# EAGLE design control_avr_rev_a (EAGLE 6.1)

## Sheet 1 of 4: Microcontroller
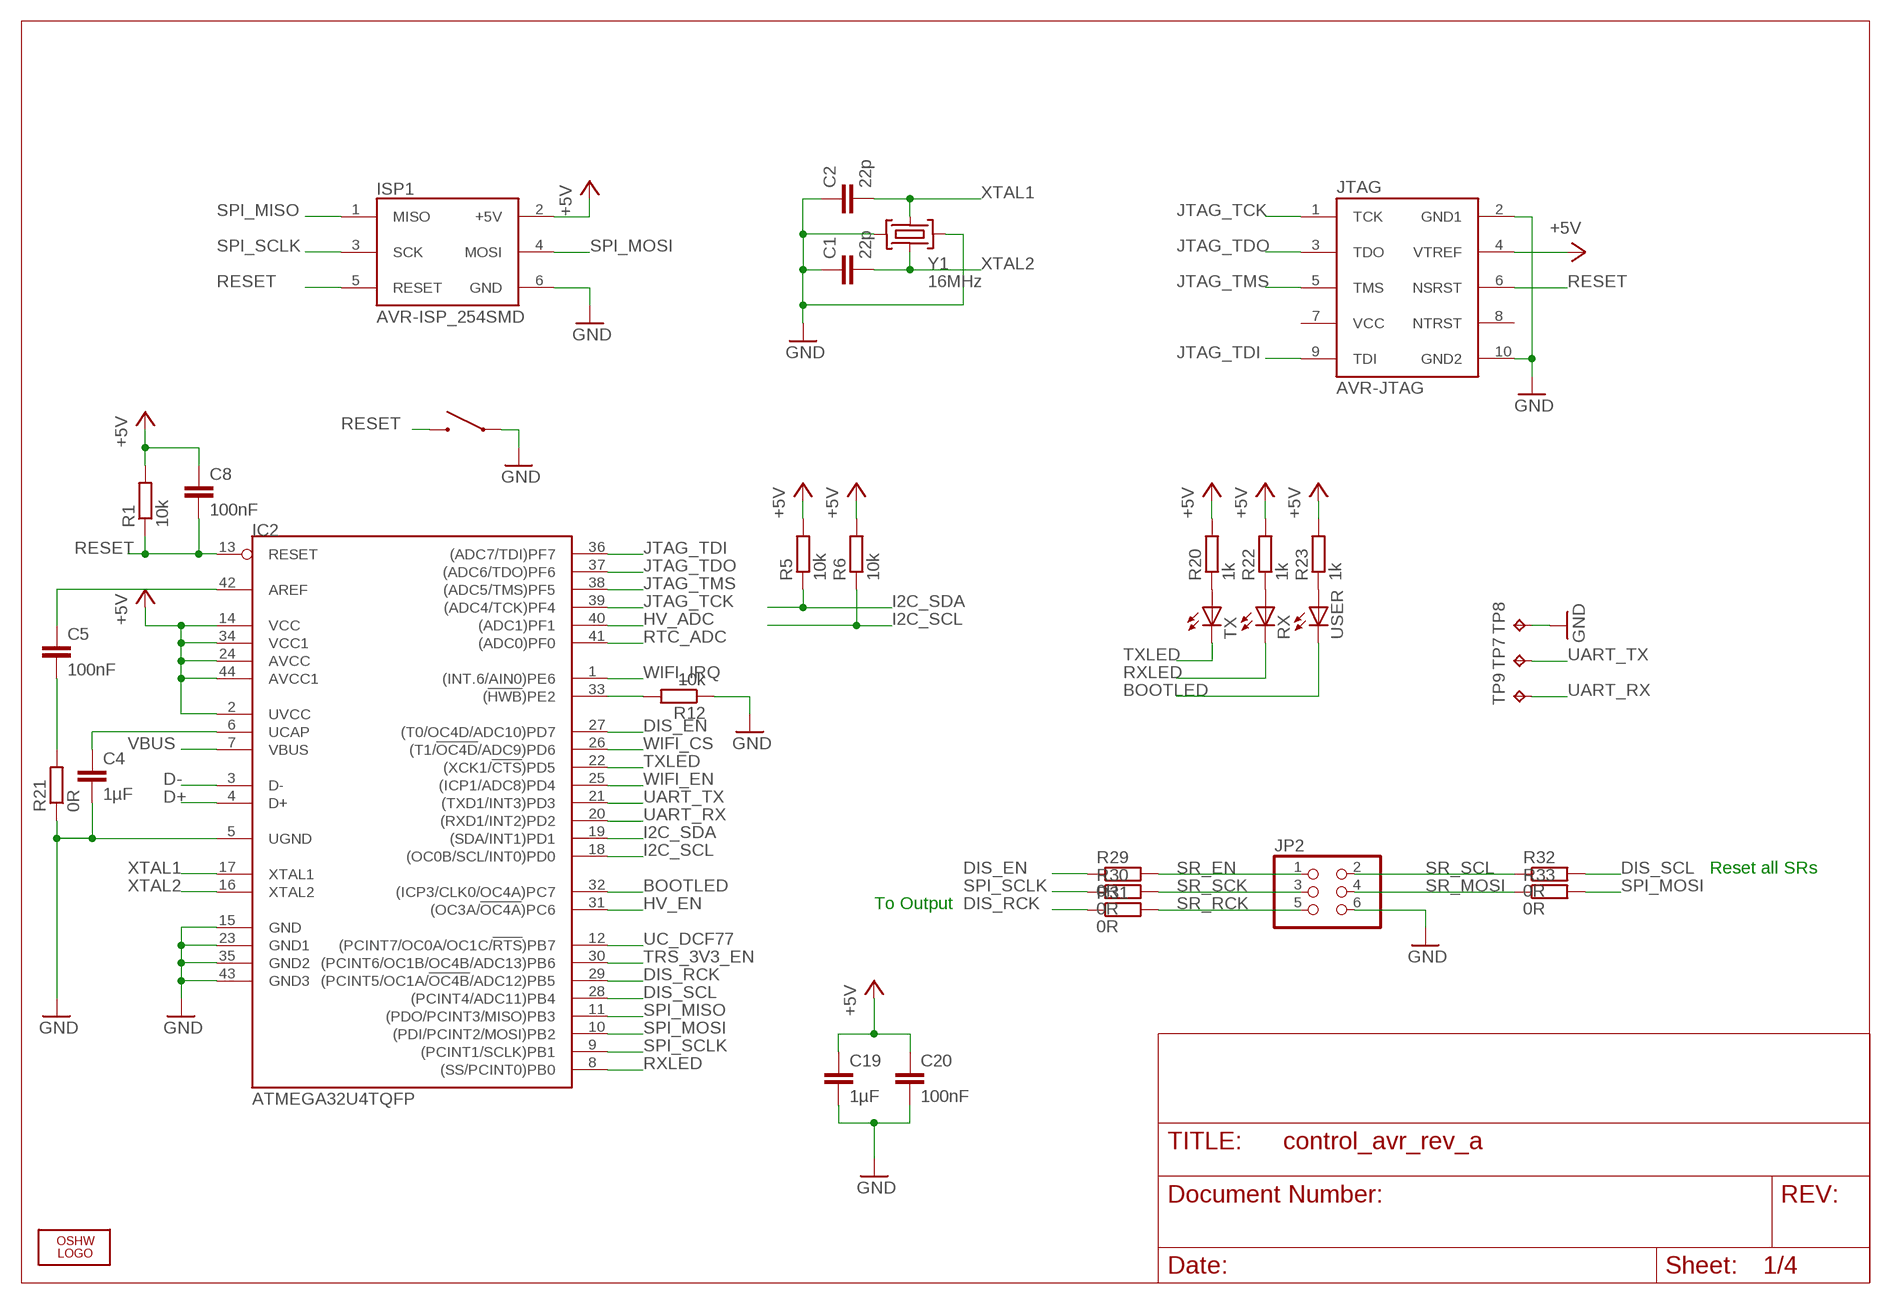
[diagram p0: schematic, sheet 1]

### Parts
C1  22p  C-EUC0603  [C0603]
C2  22p  C-EUC0603  [C0603]
C4  1µF  C-EUC0603  [C0603]
C5  100nF  C-EUC0603  [C0603]
C8  100nF  C-EUC0603  [C0603]
C19  1µF  C-EUC0603  [C0603]
C20  100nF  C-EUC0603  [C0603]
IC2  ATMEGA32U4TQFP  [TQFP44]
ISP1  AVR-ISP_254SMD  [2X03SMD]
JP2  PINHD-2X3_2.54-SMD-R  [2X03SMD/R]
JTAG  AVR-JTAG  [20021121-10010XXLF]
LOGO1  OSHW_LOGO_FILLX0200-NT  [OSHW_FILLX200_NOTEXT]
R1  10k  R-EU_R0603  [R0603]
R5  10k  R-EU_R0603  [R0603]
R6  10k  R-EU_R0603  [R0603]
R12  10k  R-EU_R0603  [R0603]
R20  1k  R-EU_R0603  [R0603]
R21  0R  R-EU_R0603  [R0603]
R22  1k  R-EU_R0603  [R0603]
R23  1k  R-EU_R0603  [R0603]
R29  0R  R-EU_R0603  [R0603]
R30  0R  R-EU_R0603  [R0603]
R31  0R  R-EU_R0603  [R0603]
R32  0R  R-EU_R0603  [R0603]
R33  0R  R-EU_R0603  [R0603]
RESET  TACT-SWITCH-47-35  [47-35]
RX  LEDCHIP-LED0603  [CHIP-LED0603]
TP7  TPTP10R  [TP10R]
TP8  TPTP10SQ  [TP10SQ]
TP9  TPTP10R  [TP10R]
TX  LEDCHIP-LED0603  [CHIP-LED0603]
USER  LEDCHIP-LED0603  [CHIP-LED0603]
Y1  16MHz  X22-CRYSTAL  [X22]

### Nets
+5V: C8.1 C19.1 C20.1 IC2.2(UVCC) IC2.14(VCC) IC2.24(AVCC) IC2.34(VCC1) IC2.44(AVCC1) ISP1.2(+5V) JTAG.4(VTREF) R1.2 R5.2 R6.2 R20.2 R22.2 R23.2 ; also sheet 2,4
BOOTLED: IC2.32((ICP3/CLK0/OC4A)PC7) USER.C
D+: IC2.4(D+) ; also sheet 4
D-: IC2.3(D-) ; also sheet 4
DIS_EN: IC2.27((T0/OC4D/ADC10)PD7) R29.1
DIS_RCK: IC2.29((PCINT5/OC1A/!OC4B!/ADC12)PB5) R31.1
DIS_SCL: IC2.28((PCINT4/ADC11)PB4) R32.2
GND: C1.1 C2.1 C4.2 C19.2 C20.2 IC2.5(UGND) IC2.15(GND) IC2.23(GND1) IC2.35(GND2) IC2.43(GND3) ISP1.6(GND) JP2.6 JTAG.2(GND1) JTAG.10(GND2) R12.1 R21.1 RESET.C RESET.D TP8.TP Y1.P$1(GND1) Y1.P$3(GND2) ; also sheet 2,3,4
HV_ADC: IC2.40((ADC1)PF1) ; also sheet 4
HV_EN: IC2.31((OC3A/!OC4A!)PC6) ; also sheet 4
I2C_SCL: IC2.18((OC0B/SCL/INT0)PD0) R6.1 ; also sheet 2
I2C_SDA: IC2.19((SDA/INT1)PD1) R5.1 ; also sheet 2
JTAG_TCK: IC2.39((ADC4/TCK)PF4) JTAG.1(TCK)
JTAG_TDI: IC2.36((ADC7/TDI)PF7) JTAG.9(TDI)
JTAG_TDO: IC2.37((ADC6/TDO)PF6) JTAG.3(TDO)
JTAG_TMS: IC2.38((ADC5/TMS)PF5) JTAG.5(TMS)
N$3: R20.1 TX.A
N$6: IC2.33((!HWB!)PE2) R12.2
N$8: C5.2 R21.2
N$9: C5.1 IC2.42(AREF)
N$10: R22.1 RX.A
N$11: R23.1 USER.A
RESET: C8.2 IC2.13(RESET) ISP1.5(RESET) JTAG.6(NSRST) R1.1 RESET.A RESET.B
RTC_ADC: IC2.41((ADC0)PF0) ; also sheet 2
RXLED: IC2.8((SS/PCINT0)PB0) RX.C
SPI_MISO: IC2.11((PDO/PCINT3/MISO)PB3) ISP1.1(MISO) ; also sheet 3
SPI_MOSI: IC2.10((PDI/PCINT2/MOSI)PB2) ISP1.4(MOSI) R33.2 ; also sheet 3
SPI_SCLK: IC2.9((PCINT1/SCLK)PB1) ISP1.3(SCK) R30.1 ; also sheet 3
SR_EN: JP2.1 R29.2
SR_MOSI: JP2.4 R33.1
SR_RCK: JP2.5 R31.2
SR_SCK: JP2.3 R30.2
SR_SCL: JP2.2 R32.1
TRS_3V3_EN: IC2.30((PCINT6/OC1B/OC4B/ADC13)PB6) ; also sheet 4
TXLED: IC2.22((XCK1/!CTS!)PD5) TX.C
UART_RX: IC2.20((RXD1/INT2)PD2) TP9.TP ; also sheet 2
UART_TX: IC2.21((TXD1/INT3)PD3) TP7.TP
UC_DCF77: IC2.12((PCINT7/OC0A/OC1C/!RTS!)PB7) ; also sheet 2
UCAP: C4.1 IC2.6(UCAP)
VBUS: IC2.7(VBUS)
WIFI_CS: IC2.26((T1/!OC4D!/ADC9)PD6) ; also sheet 3
WIFI_EN: IC2.25((ICP1/ADC8)PD4) ; also sheet 3
WIFI_IRQ: IC2.1((INT.6/AIN0)PE6) ; also sheet 3
XTAL1: C2.2 IC2.17(XTAL1) Y1.CRYSTAL2
XTAL2: C1.2 IC2.16(XTAL2) Y1.CRYSTAL1
Unconnected: JTAG.7(VCC) JTAG.8(NTRST)

### Notes on the sheet
- Reset all SRs
- To Output

## Sheet 2 of 4: Timesources
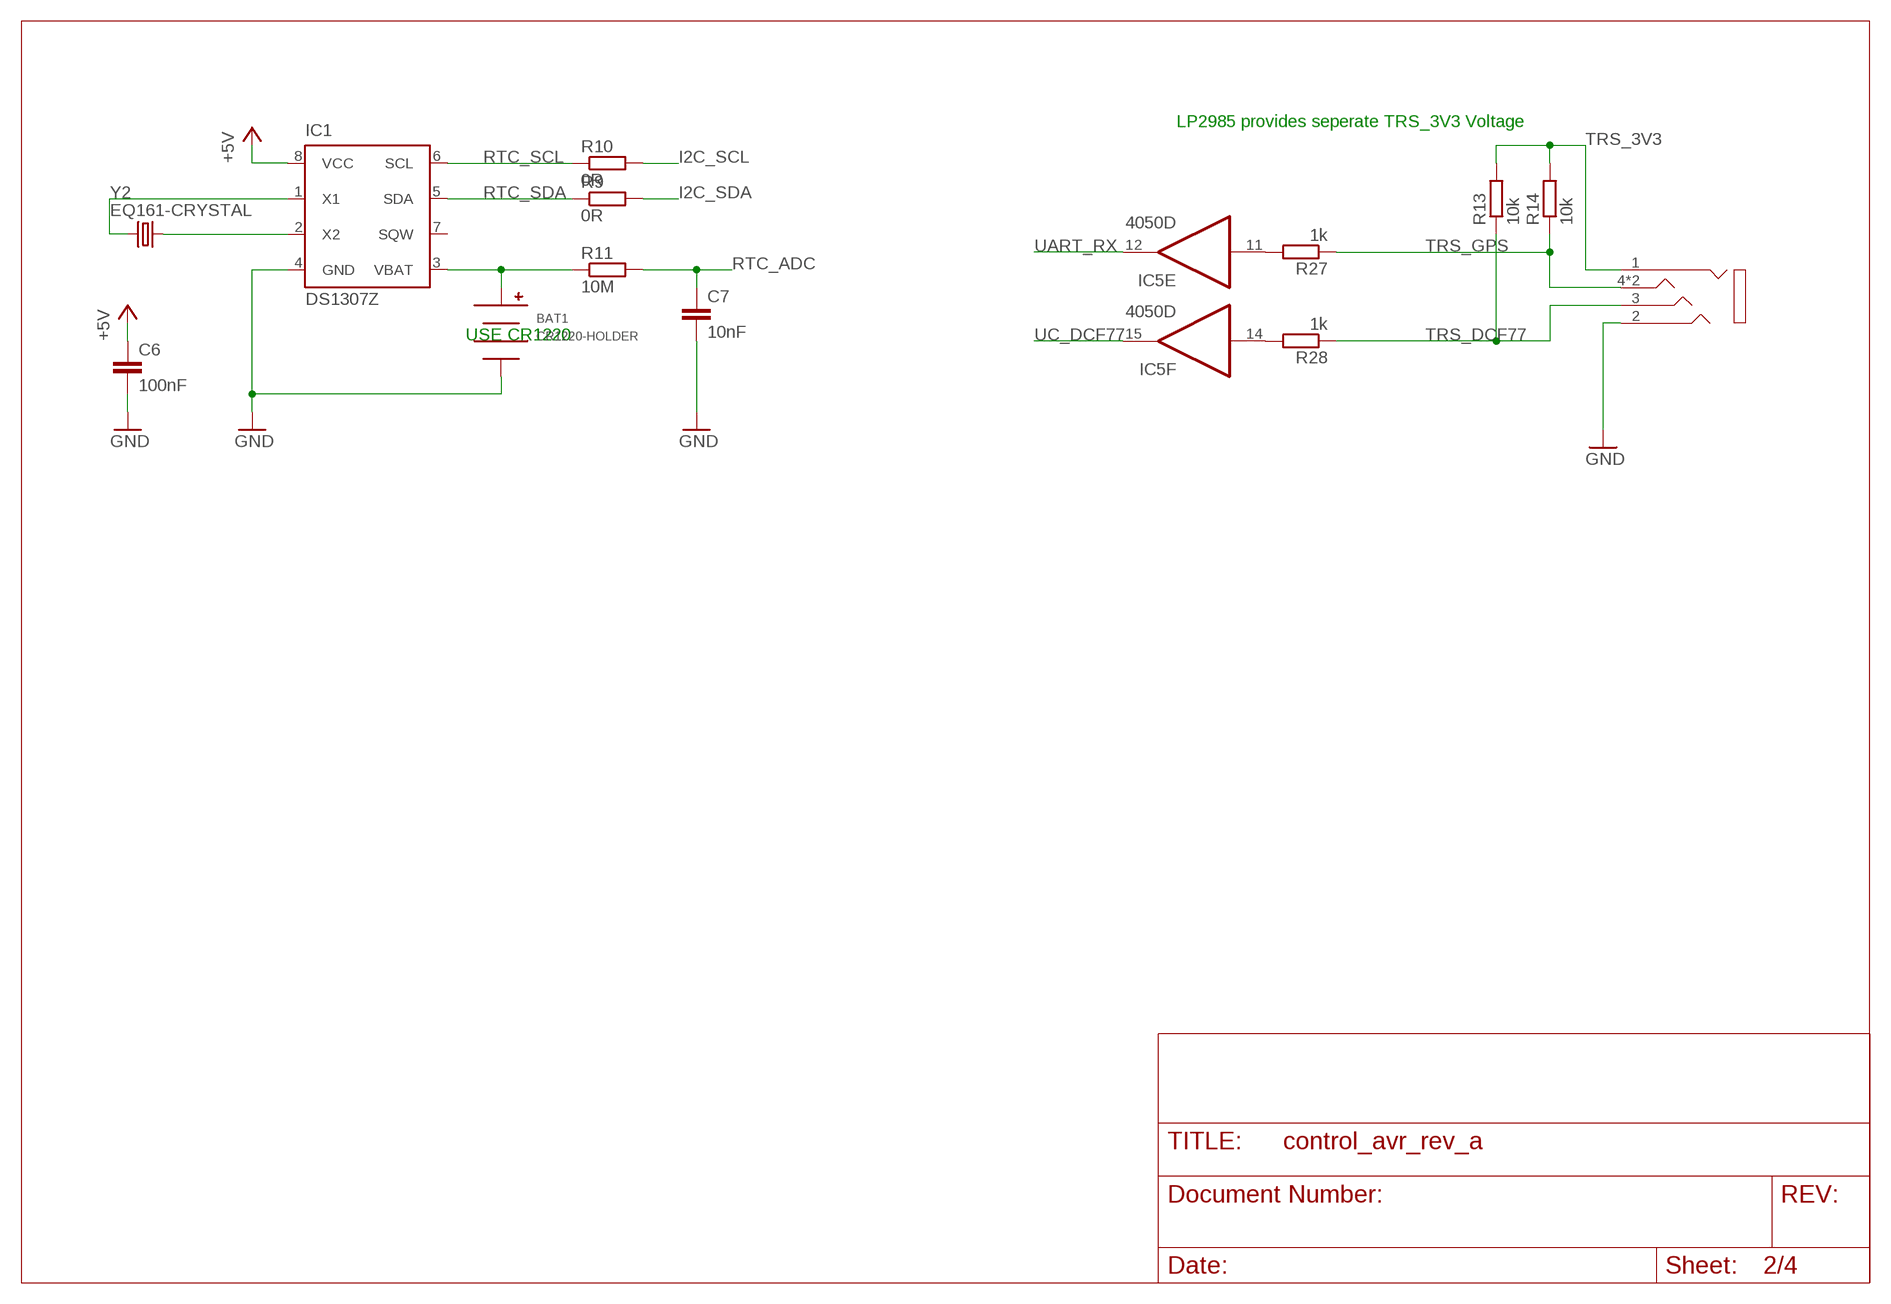
[diagram p1: schematic, sheet 2]

### Parts
BAT1  CR1220-HOLDER  [HARWIN-CR1220]
C6  100nF  C-EUC0603  [C0603]
C7  10nF  C-EUC0603  [C0603]
IC1  DS1307Z  [SOIC8]
IC5  4050D  [SO16]
R9  0R  R-EU_R0603  [R0603]
R10  0R  R-EU_R0603  [R0603]
R11  10M  R-EU_R0603  [R0603]
R13  10k  R-EU_R0603  [R0603]
R14  10k  R-EU_R0603  [R0603]
R27  1k  R-EU_R0603  [R0603]
R28  1k  R-EU_R0603  [R0603]
U$3  1503_13  [1503-03]
Y2  EQ161-CRYSTAL  [EQ161]

### Nets
+5V: C6.1 IC1.8(VCC) ; also sheet 1,4
GND: BAT1.NEG C6.2 C7.2 IC1.4(GND) U$3.2 ; also sheet 1,3,4
I2C_SCL: R10.2 ; also sheet 1
I2C_SDA: R9.2 ; also sheet 1
N$4: IC1.1(X1) Y2.P$2
N$5: BAT1.POS IC1.3(VBAT) R11.1
N$7: IC1.2(X2) Y2.P$1
N$15: IC5.11(E:I) R27.2
N$30: IC5.14(F:I) R28.2
RTC_ADC: C7.1 R11.2 ; also sheet 1
RTC_SCL: IC1.6(SCL) R10.1
RTC_SDA: IC1.5(SDA) R9.1
TRS_3V3: R13.2 R14.2 U$3.1 ; also sheet 4
TRS_DCF77: R13.1 R28.1 U$3.3
TRS_GPS: R14.1 R27.1 U$3.4 U$3.4-2
UART_RX: IC5.12(E:O) ; also sheet 1
UC_DCF77: IC5.15(F:O) ; also sheet 1
Unconnected: IC1.7(SQW)

### Notes on the sheet
- LP2985 provides seperate TRS_3V3 Voltage
- USE CR1220

## Sheet 3 of 4: WiFi
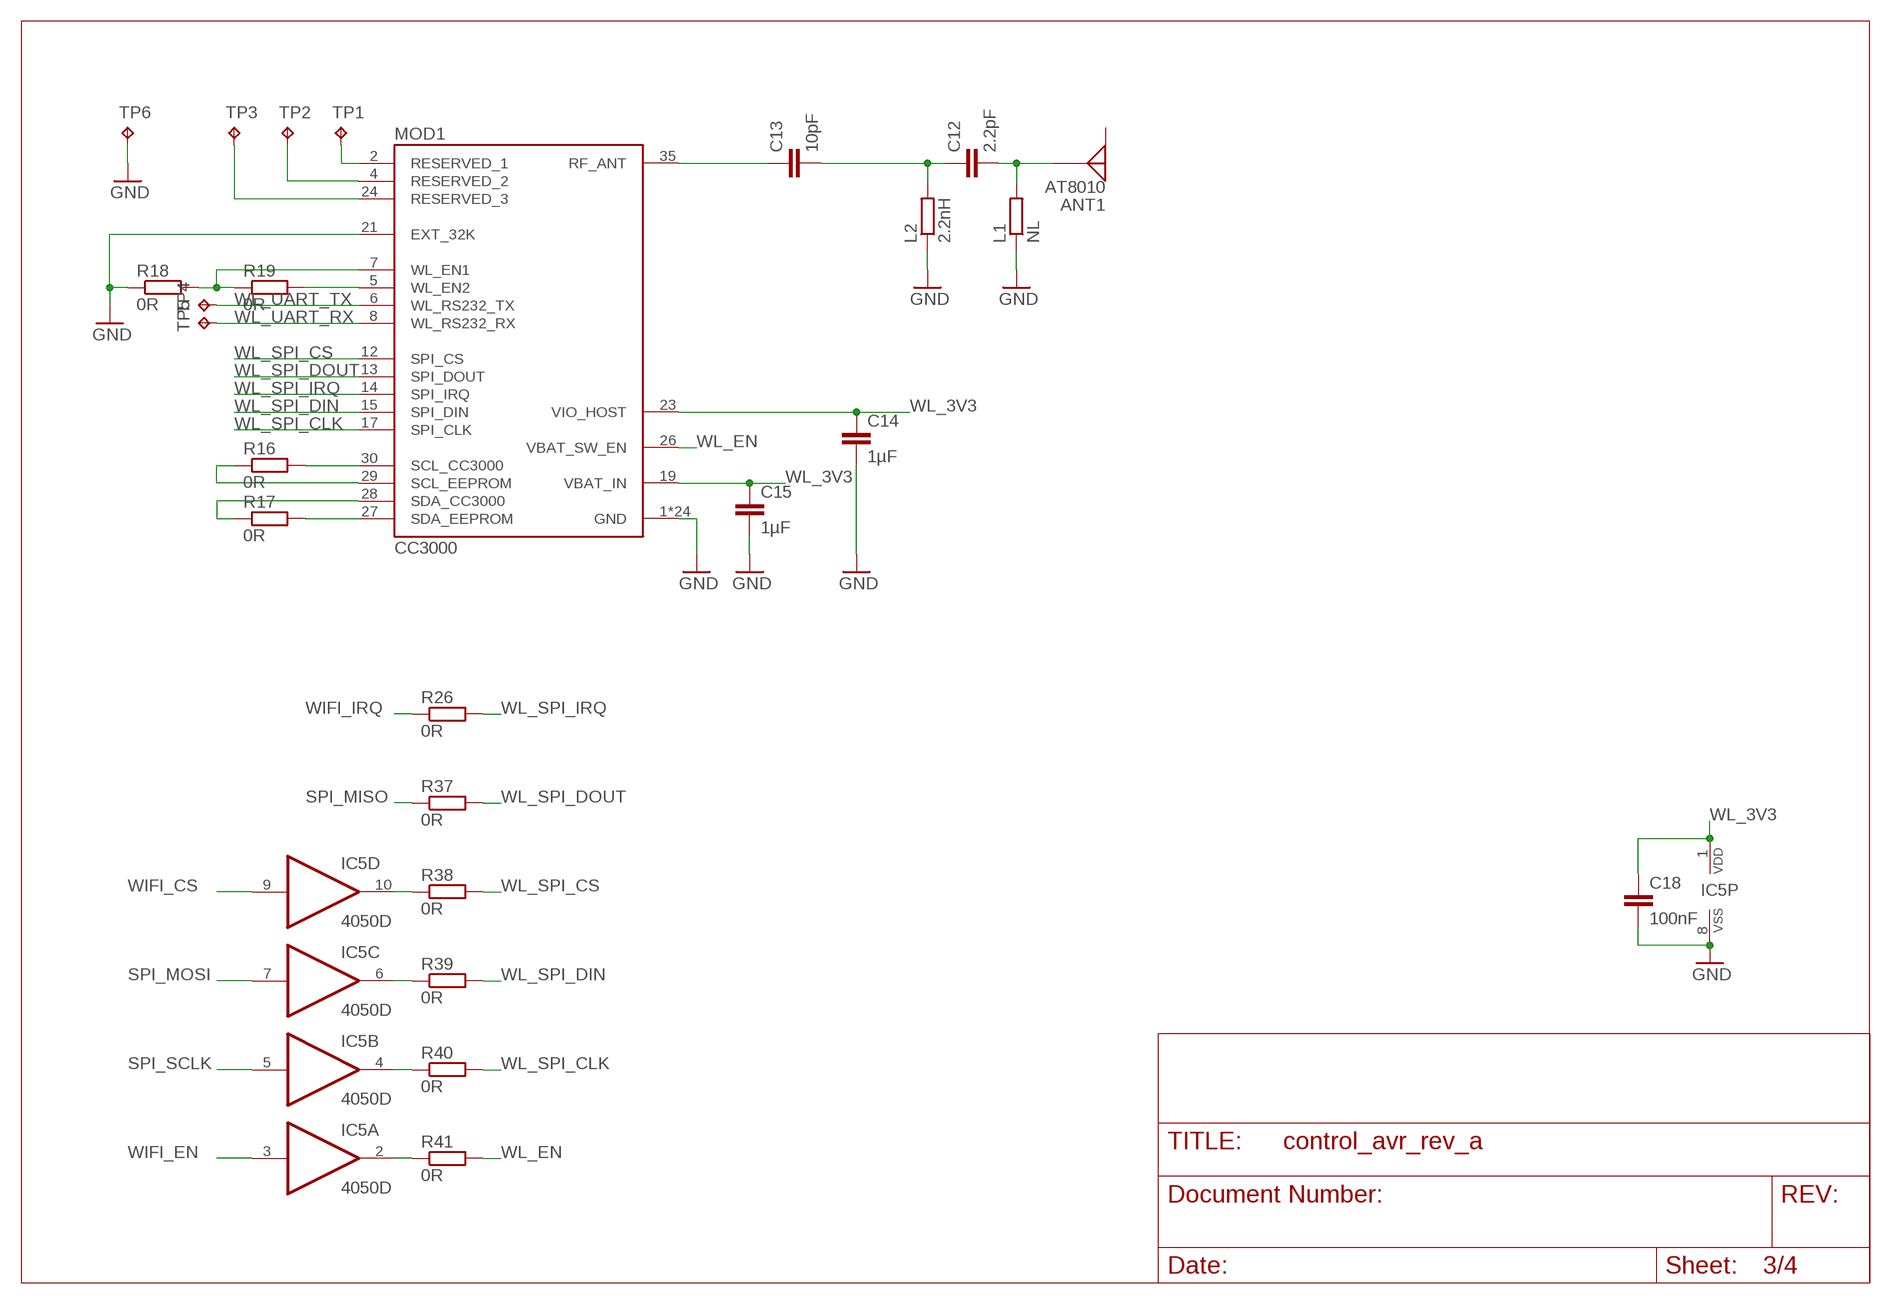
[diagram p2: schematic, sheet 3]

### Parts
ANT1  AT8010  [AT8010]
C12  2.2pF  C-EUC0402  [C0402]
C13  10pF  C-EUC0402  [C0402]
C14  1µF  C-EUC0603  [C0603]
C15  1µF  C-EUC0603  [C0603]
C18  100nF  C-EUC0603  [C0603]
L1  NL  R-EU_R0402  [R0402]
L2  2.2nH  R-EU_R0402  [R0402]
MOD1  CC3000  [CC3000]
R16  0R  R-EU_R0603  [R0603]
R17  0R  R-EU_R0603  [R0603]
R18  0R  R-EU_R0603  [R0603]
R19  0R  R-EU_R0603  [R0603]
R26  0R  R-EU_R0603  [R0603]
R37  0R  R-EU_R0603  [R0603]
R38  0R  R-EU_R0603  [R0603]
R39  0R  R-EU_R0603  [R0603]
R40  0R  R-EU_R0603  [R0603]
R41  0R  R-EU_R0603  [R0603]
TP1  TPTP06R  [TP06R]
TP2  TPTP06R  [TP06R]
TP3  TPTP06R  [TP06R]
TP4  TPTP10R  [TP10R]
TP5  TPTP10R  [TP10R]
TP6  TPTP10SQ  [TP10SQ]

### Nets
GND: C14.2 C15.2 C18.2 IC5.8(P:VSS) L1.1 L2.1 MOD1.1(GND) MOD1.9(GND) MOD1.10(GND) MOD1.11(GND) MOD1.16(GND) MOD1.18(GND) MOD1.20(GND) MOD1.21(EXT_32K) MOD1.22(GND) MOD1.25(GND) MOD1.31(GND) MOD1.32(GND) MOD1.33(GND) MOD1.34(GND) MOD1.36(GND) MOD1.37(GND) MOD1.38(GND) MOD1.39(GND) MOD1.40(GND) MOD1.41(GND) MOD1.42(GND) MOD1.43(GND) MOD1.44(GND) MOD1.45(GND) MOD1.46(GND) R18.1 TP6.TP ; also sheet 1,2,4
N$17: C13.1 MOD1.35(RF_ANT)
N$18: C12.1 C13.2 L2.2
N$19: ANT1.ANT C12.2 L1.2
N$20: MOD1.29(SCL_EEPROM) R16.1
N$21: MOD1.30(SCL_CC3000) R16.2
N$22: MOD1.27(SDA_EEPROM) R17.2
N$23: MOD1.28(SDA_CC3000) R17.1
N$24: MOD1.5(WL_EN2) R19.2
N$25: MOD1.7(WL_EN1) R18.2 R19.1
N$26: MOD1.2(RESERVED_1) TP1.TP
N$27: MOD1.4(RESERVED_2) TP2.TP
N$28: MOD1.24(RESERVED_3) TP3.TP
N$29: IC5.10(D:O) R38.1
N$31: IC5.6(C:O) R39.1
N$37: IC5.4(B:O) R40.1
N$38: IC5.2(A:O) R41.1
SPI_MISO: R37.1 ; also sheet 1
SPI_MOSI: IC5.7(C:I) ; also sheet 1
SPI_SCLK: IC5.5(B:I) ; also sheet 1
WIFI_CS: IC5.9(D:I) ; also sheet 1
WIFI_EN: IC5.3(A:I) ; also sheet 1
WIFI_IRQ: R26.1 ; also sheet 1
WL_3V3: C14.1 C15.1 C18.1 IC5.1(P:VDD) MOD1.19(VBAT_IN) MOD1.23(VIO_HOST) ; also sheet 4
WL_EN: MOD1.26(VBAT_SW_EN) R41.2
WL_SPI_CLK: MOD1.17(SPI_CLK) R40.2
WL_SPI_CS: MOD1.12(SPI_CS) R38.2
WL_SPI_DIN: MOD1.15(SPI_DIN) R39.2
WL_SPI_DOUT: MOD1.13(SPI_DOUT) R37.2
WL_SPI_IRQ: MOD1.14(SPI_IRQ) R26.2
WL_UART_RX: MOD1.8(WL_RS232_RX) TP5.TP
WL_UART_TX: MOD1.6(WL_RS232_TX) TP4.TP
Unconnected: ANT1.MOUNT

## Sheet 4 of 4: Powersupply
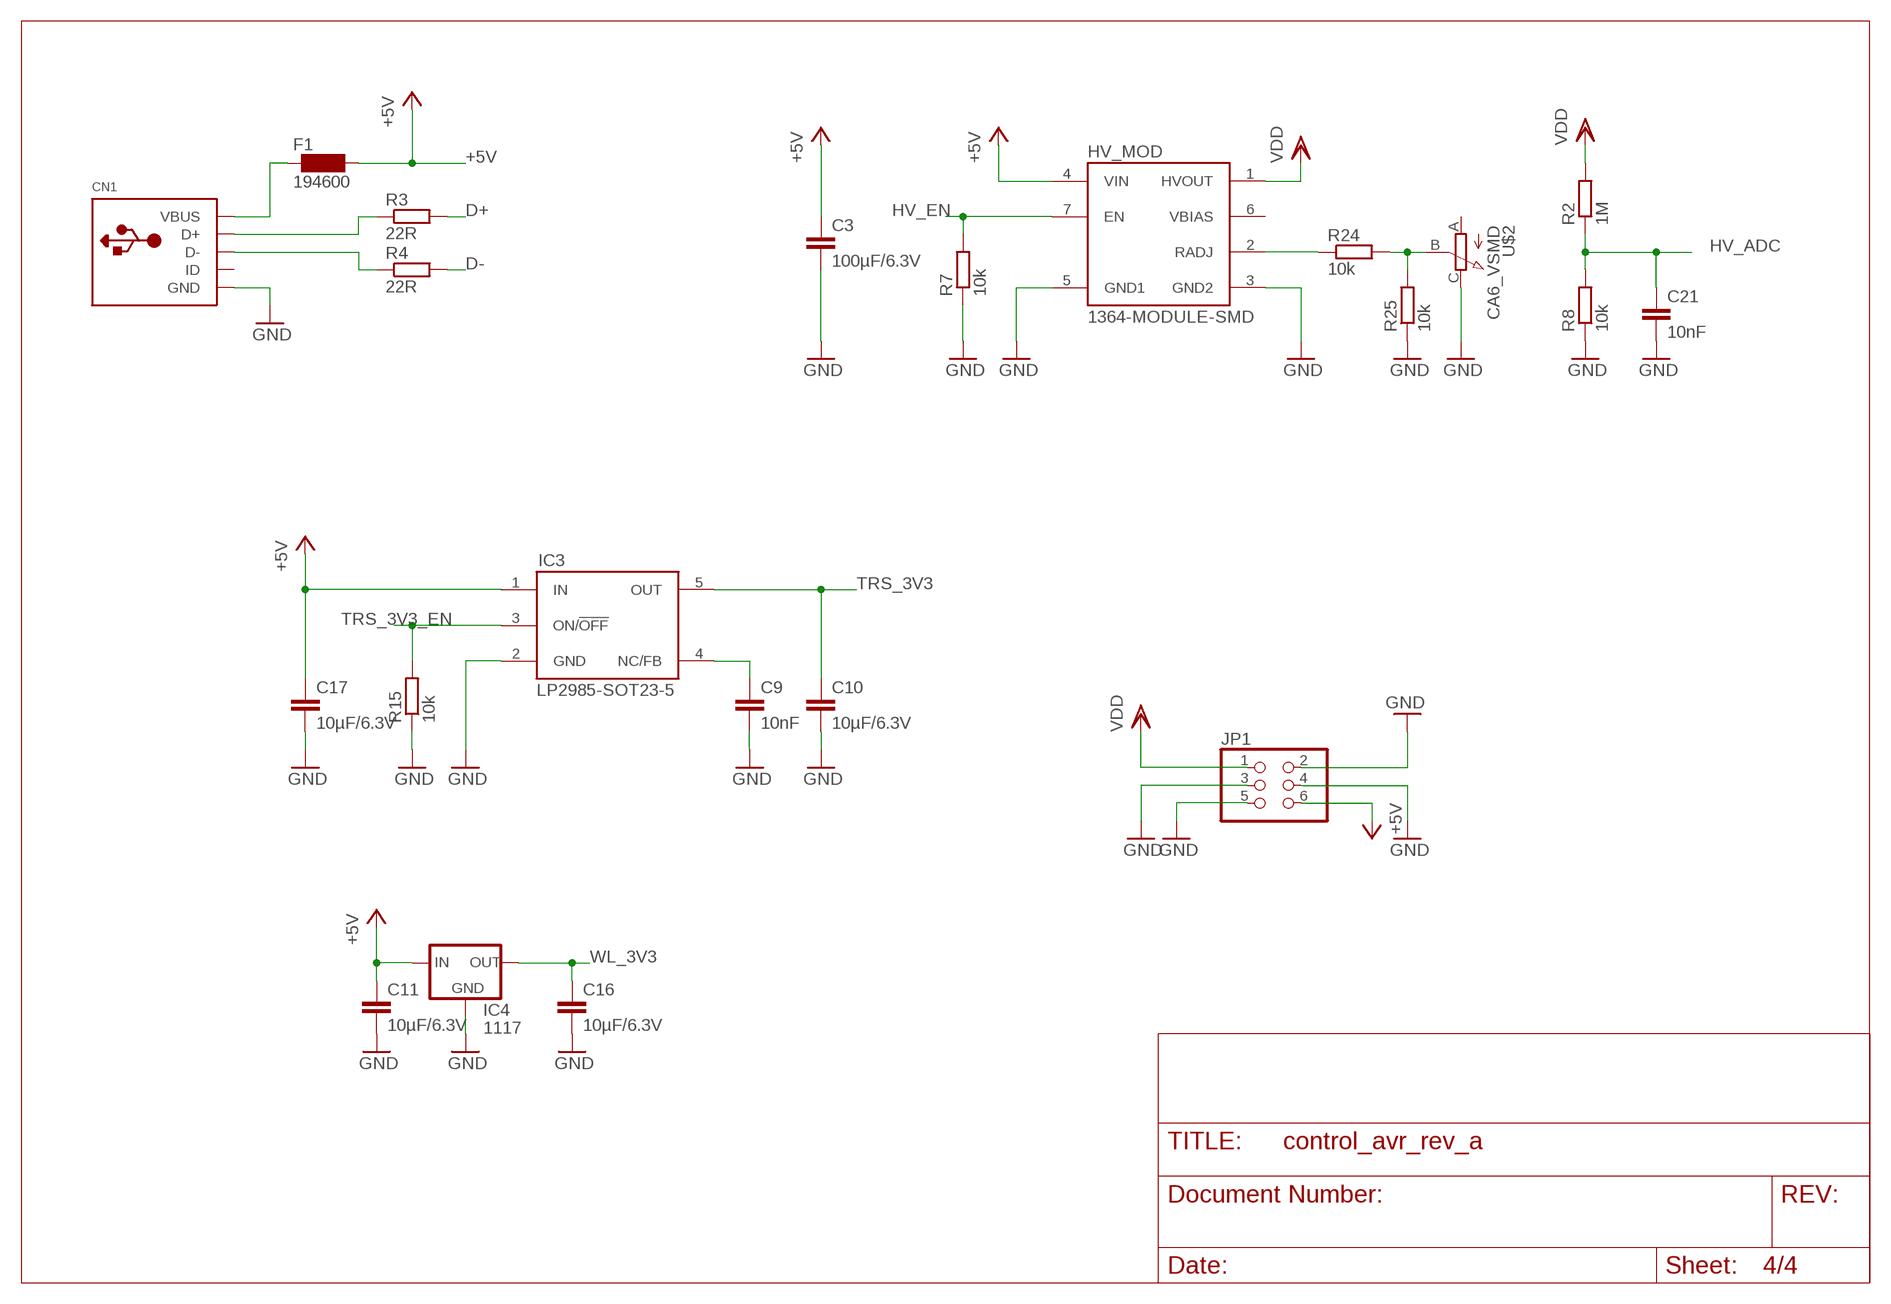
[diagram p3: schematic, sheet 4]

### Parts
C3  100µF/6.3V  C-EUC1210  [C1210]
C9  10nF  C-EUC0603  [C0603]
C10  10µF/6.3V  C-EUC0603  [C0603]
C11  10µF/6.3V  C-EUC0603  [C0603]
C16  10µF/6.3V  C-EUC0603  [C0603]
C17  10µF/6.3V  C-EUC0603  [C0603]
C21  10nF  C-EUC0603  [C0603]
CN1  USBMINIB  [USB-MINIB]
F1  194600  [1812]
HV_MOD  1364-MODULE-SMD  [1364-SMD]
IC3  LP2985-SOT23-5  [SOT23-5]
IC4  1117  [SOT223]
JP1  PINHD-2X3_2.54-SMD-R  [2X03SMD/R]
R2  1M  R-EU_R1206  [R1206]
R3  22R  R-EU_R0603  [R0603]
R4  22R  R-EU_R0603  [R0603]
R7  10k  R-EU_R0603  [R0603]
R8  10k  R-EU_R0603  [R0603]
R15  10k  R-EU_R0603  [R0603]
R24  10k  R-EU_R0603  [R0603]
R25  10k  R-EU_R0603  [R0603]
U$2  CA6_VSMD  [CA6-VSMD]

### Nets
+5V: C3.1 C11.1 C17.1 F1.P$2 HV_MOD.4(VIN) IC3.1(IN) IC4.3(IN) JP1.6 ; also sheet 1,2
D+: R3.2 ; also sheet 1
D-: R4.2 ; also sheet 1
GND: C3.2 C9.2 C10.2 C11.2 C16.2 C17.2 C21.2 CN1.GND HV_MOD.3(GND2) HV_MOD.5(GND1) IC3.2(GND) IC4.1(GND) JP1.2 JP1.3 JP1.4 JP1.5 R7.1 R8.1 R15.1 R25.1 U$2.C(E) ; also sheet 1,2,3
HV_ADC: C21.1 R2.1 R8.2 ; also sheet 1
HV_EN: HV_MOD.7(EN) R7.2 ; also sheet 1
N$1: CN1.D- R4.1
N$2: CN1.D+ R3.1
N$12: CN1.VBUS F1.P$1
N$13: HV_MOD.2(RADJ) R24.1
N$14: R24.2 R25.2 U$2.B(S)
N$16: C9.1 IC3.4(NC/FB)
TRS_3V3: C10.1 IC3.5(OUT) ; also sheet 2
TRS_3V3_EN: IC3.3(ON/!OFF) R15.2 ; also sheet 1
VDD: HV_MOD.1(HVOUT) JP1.1 R2.2
WL_3V3: C16.1 IC4.2(OUT) IC4.4(OUT) ; also sheet 3
Unconnected: CN1.ID HV_MOD.6(VBIAS) U$2.A

## Library data of the parts
ANT1 = acx:AT8010: AT8010 Series Multilayer Chip Antenna
BAT1 = battery-holder:CR1220-HOLDER
C1-C21 = rcl:C-EU: CAPACITOR, European symbol
CN1 = adafruit:USB: USB Connectors USBMINIB - Surface Mount Female Mini-B USB Connector [Part No.] 4UConnector: 06564 By microbuilder.eu
F1 = siba:194600: PTC-Fuse 1812
HV_MOD = TES:1364-MODULE-SMD: The 1363/1364 series high voltage power supplies are miniature flyback boost converters operating from 2 to 16VDC input, with an output of 150 to 200VDC set by a single resistor to ground and below 150V with an external bias (See Fig 6b). An enable pin allows the module to be controlled by an external logic signal, drawing only 40uA in shut down.
IC1 = ds1307_pcf8583:DS1307: I2C-Bus CLOCK/CALENDAR
IC2 = avr:ATMEGA32U4: The ATmega16U4/ATmega32U4 is a low-power CMOS 8-bit microcontroller based on the AVR enhanced RISC architecture.
IC3 = vreg:LP2985
IC4 = vreg:1117
IC5 = 40xx:4050: Hex non-inverting BUFFER
ISP1 = avr:AVR-ISP: AVR In-System-Programming Port
JP1 JP2 = con-interboard:PINHD-2X3: PIN HEADER
JTAG = avr:AVR-JTAG: AVR JTAG Port
L1 L2 R1-R33 R37-R41 = rcl:R-EU_: RESISTOR, European symbol
LOGO1 = ohw-logo:OSHW_LOGO_FILL
MOD1 = ti:CC3000
RESET = tactile-switch:TACT-SWITCH-47-35
RX TX USER = led:LED: LED OSRAM: - CHIPLED LG R971, LG N971, LY N971, LG Q971, LY Q971, LO R971, LY R971 LH N974, LH R974 LS Q976, LO Q976, LY Q976 LO Q996 - Hyper CHIPLED LW Q18S LB Q993, LB Q99A, LB R99A - SideLED LS A670, LO A670, LY A670, LG A670, LP A670 LB A673, LV A673, LT A673, LW A673 LH A674 LY A675 LS A676, LA A676, LO A676, LY A676, LW A676 LS A679, LY A679, LG A679 - Hyper Micro SIDELED® LS Y876, LA Y876, LO Y876, LY Y876 LT Y87S - SmartLED LW L88C, LW L88S LB L89C, LB L89S, LG L890 LS L89K, LO L89K, LY L89K LS L896, LA L896, LO L896, LY L896 - TOPLED LS T670, LO T670, LY T670, LG T670, LP T670 LSG T670, LSP T670, LSY T670, LOP T670, LYG T670 LG T671, LOG T671, LSG T671 LB T673, LV T673, LT T673, LW T673 LH T674 LS T676, LA T676, LO T676, LY T676, LB T676, LH T676, LSB T676, LW T676 LB T67C, LV T67C, LT T67C, LS T67K, LO T67K, LY T67K, LW E67C LS E67B, LA E67B, LO E67B, LY E67B, LB E67C, LV E67C, LT E67C LW T67C LS T679, LY T679, LG T679 LS T770, LO T770, LY T770, LG T770, LP T770 LB T773, LV T773, LT T773, LW T773 LH T774 LS E675, LA E675, LY E675, LS T675 LS T776, LA T776, LO T776, LY T776, LB T776 LHGB T686 LT T68C, LB T68C - Hyper Mini TOPLED® LB M676 - Mini TOPLED Santana® LG M470 LS M47K, LO M47K, LY M47K Source: http://www.osram.convergy.de LUXEON: - LUMILED® LXK2-PW12-R00, LXK2-PW12-S00, LXK2-PW14-U00, LXK2-PW14-V00 LXK2-PM12-R00, LXK2-PM12-S00, LXK2-PM14-U00 LXK2-PE12-Q00, LXK2-PE12-R00, LXK2-PE12-S00, LXK2-PE14-T00, LXK2-PE14-U00 LXK2-PB12-K00, LXK2-PB12-L00, LXK2-PB12-M00, LXK2-PB14-N00, LXK2-PB14-P00, LXK2-PB14-Q00 LXK2-PR12-L00, LXK2-PR12-M00, LXK2-PR14-Q00, LXK2-PR14-R00 LXK2-PD12-Q00, LXK2-PD12-R00, LXK2-PD12-S00 LXK2-PH12-R00, LXK2-PH12-S00 LXK2-PL12-P00, LXK2-PL12-Q00, LXK2-PL12-R00 Source: www.luxeon.com KINGBRIGHT: KA-3528ASYC Source: www.kingbright.com
TP1-TP9 = testpad:TP: Test pad
U$2 = acp:CA6
U$3 = con-lumberg:1503_13
Y1 = euroquartz:X22-CRYSTAL: Ultra-miniature package 2.5 x 2.0 x 0.6mm
Y2 = euroquartz:EQ161-CRYSTAL: ￼Miniature SMD 3.2 x 1.5 x 0.75mm

## Board
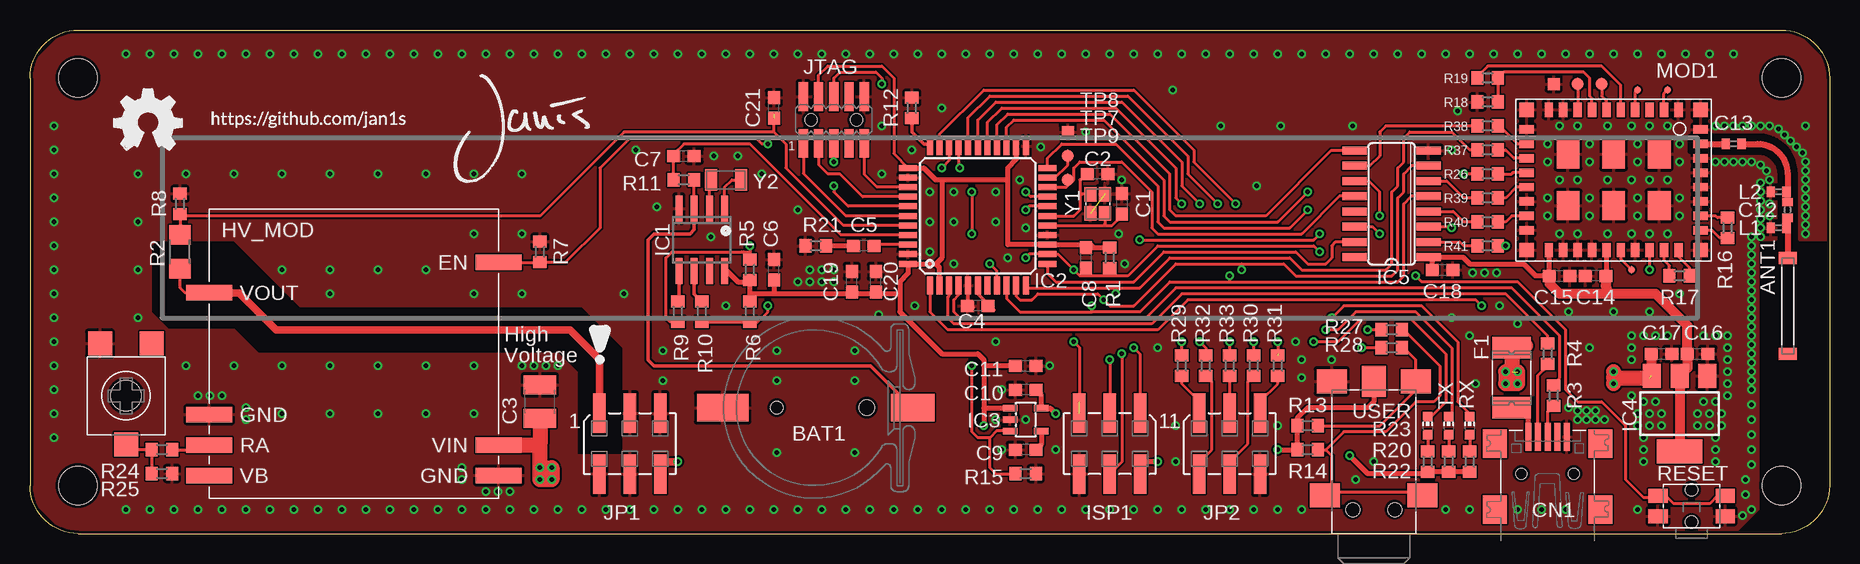
[diagram p4: board, top side]
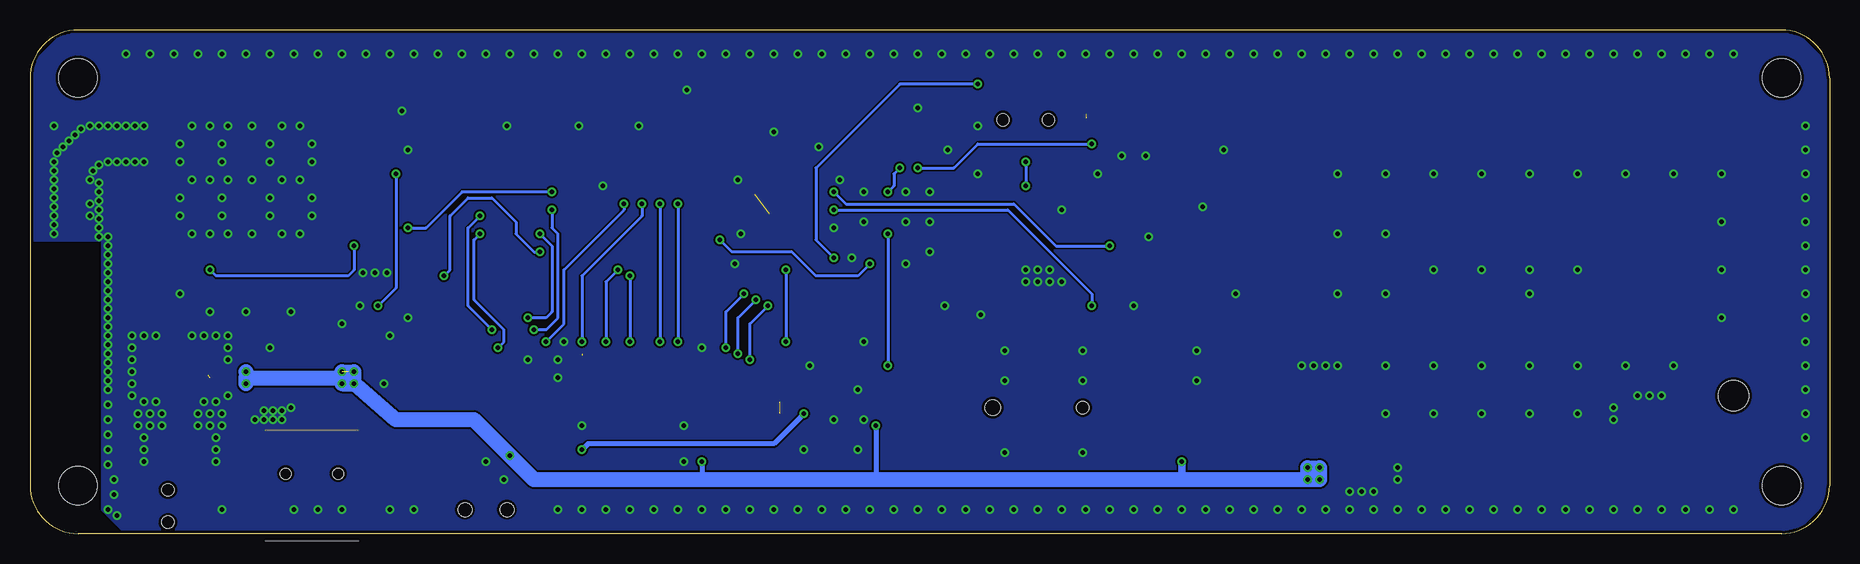
[diagram p5: board, bottom side, seen from below]

Size 150 x 42 mm. Coordinates in mm from the lower left corner, seen from the top.
Outline: 4,0 146,0 arc90 150,4 150,38 arc90 146,42 4,42 arc90 0,38 0,4 arc90 4,0
Copper layers (1*16): Top 0.035mm / dielectric 1.5mm / Bottom 0.035mm
Design rules: minimum track width 6mil, minimum drill 12mil, track to track 6mil, track to pad 6mil, pad to pad 6mil, via to via 6mil, smd to smd 0mil, copper to edge 10mil, drill to drill 10mil, minimum pad ring 10mil, minimum via ring 6mil, stop-mask expansion 2mil, vias tented up to drill 100mil, thermal gap 10mil
Holes 3.2 mm at 4,38 146,38 146,4 4,4

### Footprints (pad centres in the part's own frame; a part is rotated, then mirrored left to right if it is on the bottom)
AT8010 = smd 1 x 1.5: ANT 4,0; MOUNT -4,0
HARWIN-CR1220 = smd 2.3 x 4.3: NEG 0,8.26 | smd 2.3 x 3.66: POS 0,-7.58 | hole 1: 0,3.75 | hole 1.25: 0,-3.75
C0603 = smd 1.1 x 1: 1 -0.85,0; 2 0.85,0
C1210 = smd 1.6 x 2.7: 1 -1.4,0; 2 1.4,0
C0402 = smd 0.7 x 0.9: 1 -0.65,0; 2 0.65,0
USB-MINIB = smd 0.5 x 2.308: D+ 0,4.064; D- -0.8,4.064; GND 1.6,4.064; ID 0.8,4.064; VBUS -1.6,4.064 | smd 2 x 2.4: GND1 -4.4,-2; GND2 -4.4,3.5; GND3 4.4,3.5; GND4 4.4,-2 | hole 0.9: -2.2,1; 2.2,1
1812 = smd 1.78 x 3.2: P$1 -2.5,0; P$2 2.5,0
1364-SMD = smd 1.27 x 3.81: 1 5.08,12.065; 2 -7.62,12.065; 3 -5.08,12.065; 4 -7.62,-12.065; 5 -10.16,-12.065; 6 -10.16,12.065; 7 7.62,-12.065
SOIC8 = smd 0.6 x 2.2: 1 -1.905,-2.6; 2 -0.635,-2.6; 3 0.635,-2.6; 4 1.905,-2.6; 5 1.905,2.6; 6 0.635,2.6; 7 -0.635,2.6; 8 -1.905,2.6
TQFP44 = smd 1.5 x 0.5: 1 -5.8,4; 2 -5.8,3.2; 3 -5.8,2.4; 4 -5.8,1.6; 5 -5.8,0.8; 6 -5.8,0; 7 -5.8,-0.8; 8 -5.8,-1.6; 9 -5.8,-2.4; 10 -5.8,-3.2; 11 -5.8,-4; 23 5.8,-4; 24 5.8,-3.2; 25 5.8,-2.4; 26 5.8,-1.6; 27 5.8,-0.8; 28 5.8,0; 29 5.8,0.8; 30 5.8,1.6; 31 5.8,2.4; 32 5.8,3.2; 33 5.8,4 | smd 0.5 x 1.5: 12 -4,-5.8; 13 -3.2,-5.8; 14 -2.4,-5.8; 15 -1.6,-5.8; 16 -0.8,-5.8; 17 0,-5.8; 18 0.8,-5.8; 19 1.6,-5.8; 20 2.4,-5.8; 21 3.2,-5.8; 22 4,-5.8; 34 4,5.8; 35 3.2,5.8; 36 2.4,5.8; 37 1.6,5.8; 38 0.8,5.8; 39 0,5.8; 40 -0.8,5.8; 41 -1.6,5.8; 42 -2.4,5.8; 43 -3.2,5.8; 44 -4,5.8
SOT23-5 = smd 0.55 x 1.2: 1 -0.95,-1.3; 2 0,-1.3; 3 0.95,-1.3; 4 0.95,1.3; 5 -0.95,1.3
SOT223 = smd 1.5 x 2: 1 -2.3,-3.15; 2 0,-3.15; 3 2.3,-3.15 | smd 3.8 x 2: 4 0,3.15
SO16 = smd 0.66 x 2.032: 1 -4.445,-3.073; 2 -3.175,-3.073; 3 -1.905,-3.073; 4 -0.635,-3.073; 5 0.635,-3.073; 6 1.905,-3.073; 7 3.175,-3.073; 8 4.445,-3.073; 9 4.445,3.073; 10 3.175,3.073; 11 1.905,3.073; 12 0.635,3.073; 13 -0.635,3.073; 14 -1.905,3.073; 15 -3.175,3.073; 16 -4.445,3.073
2X03SMD = smd 1.016 x 3.302: 1 -2.54,-2.54; 2 -2.54,2.54; 3 0,-2.54; 4 0,2.54; 5 2.54,-2.54; 6 2.54,2.54
2X03SMD/R = smd 1.016 x 3.302: 1 -2.54,2.54; 2 -2.54,-2.54; 3 0,2.54; 4 0,-2.54; 5 2.54,2.54; 6 2.54,-2.54
20021121-10010XXLF = smd 0.76 x 2.4: 1 -2.54,-1.95; 2 -2.54,1.95; 3 -1.27,-1.95; 4 -1.27,1.95; 5 0,-1.95; 6 0,1.95; 7 1.27,-1.95; 8 1.27,1.95; 9 2.54,-1.95; 10 2.54,1.95 | hole 1: -1.905,0; 1.905,0
R0402 = smd 0.7 x 0.9: 1 -0.65,0; 2 0.65,0
CC3000 = smd 1.2 x 0.7: 1 -5.85,5.4; 2 -5.85,4.2; 3 -5.85,3; 4 -5.85,1.8; 5 -5.85,0.6; 6 -5.85,-0.6; 7 -5.85,-1.8; 8 -5.85,-3; 9 -5.85,-4.2; 10 -5.85,-5.4; 19 5.85,-5.4; 20 5.85,-4.2; 21 5.85,-3; 22 5.85,-1.8; 23 5.85,-0.6; 24 5.85,0.6; 25 5.85,1.8; 26 5.85,3; 27 5.85,4.2; 28 5.85,5.4 | smd 0.7 x 1.2: 11 -4.2,-7.25; 12 -3,-7.25; 13 -1.8,-7.25; 14 -0.6,-7.25; 15 0.6,-7.25; 16 1.8,-7.25; 17 3,-7.25; 18 4.2,-7.25; 29 4.2,7.25; 30 3,7.25; 31 1.8,7.25; 32 0.6,7.25; 33 -0.6,7.25; 34 -1.8,7.25; 35 -3,7.25; 36 -4.2,7.25 | smd 2.4 x 1.9: 37 -2.15,3.8; 38 -2.15,0; 39 -2.15,-3.8; 40 2.15,3.8; 41 2.15,0; 42 2.15,-3.8 | smd 1.2 x 1.2: 43 -5.85,7.25; 44 -5.85,-7.25; 45 5.85,-7.25; 46 5.85,7.25
R0603 = smd 1 x 1.1: 1 -0.85,0; 2 0.85,0
R1206 = smd 1.6 x 1.803: 1 -1.422,0; 2 1.422,0
47-35 = smd 1.6 x 1.15: A -2.8,2.65; B 2.8,2.65; C -2.8,0.95; D 2.8,0.95 | hole 1: 0,0.45; 0,3.15
CHIP-LED0603 = smd 0.8 x 0.8: A 0,-0.75; C 0,0.75
TP06R = smd 0.6 x 0.6: TP 0,0
TP10R = smd 1 x 1: TP 0,0
TP10SQ = smd 1 x 1: TP 0,0
CA6-VSMD = smd 2 x 2: A -2.15,-4.35; B 0,4.05; C 2.15,-4.35 | hole 2.5: 0,0
1503-03 = smd 2.6 x 2: 1 12.7,0 | smd 2 x 2.5: 2 12.7,3.5; 3 12.7,-3.5; 4 3.2,4.05; 4-2 3.2,-4.05 | hole 1.15: 2,-1.75; 2,1.75
X22 = smd 1.2 x 1: CRYSTAL1 -0.8,-0.6; CRYSTAL2 0.8,0.6; P$1 -0.8,0.6; P$3 0.8,-0.6
EQ161 = smd 1 x 1.8: P$1 -1.25,0; P$2 1.25,0

### Placement (x,y rotation side)
ANT1  146.5,19 90 top
BAT1  66,10.5 90 top
C1  91,27.5 270 top
C2  89,30 180 top
C3  42.5,11 90 top
C4  79,19 180 top
C5  69.5,24 180 top
C6  62,22 90 top
C7  54.5,31.5 0 top
C8  88,23 270 top
C9  83,7 180 top
C10  83,12 180 top
C11  83,14 0 top
C12  146.5,27 270 top
C13  142,32.5 0 top
C14  130.5,21.5 180 top
C15  127.5,21.5 0 top
C16  139,15 0 top
C17  136,15 0 top
C18  117.75,22 0 top
C19  68.5,21 90 top
C20  70.5,21 90 top
C21  62,35.5 90 top
CN1  126.5,4 0 top
F1  123.5,13 90 top
HV_MOD  27,15 90 top
IC1  56,24.5 180 top
IC2  79,26.5 90 top
IC3  83,9.5 270 top
IC4  137.5,10 180 top
IC5  113.5,27.5 90 top
ISP1  90,7.5 180 top
JP1  50,7.5 0 top
JP2  100,7.5 0 top
JTAG  67,34.5 0 top
L1  145.75,25.5 0 top
L2  145.75,28.5 0 top
LOGO1  7,32 0 top
MOD1  132,29.5 270 top
R1  90,23 90 top
R2  12.5,23.5 270 top
R3  127,11.5 90 top
R4  126.5,15 90 top
R5  60,22 270 top
R6  60,18.5 90 top
R7  42.5,23.5 270 top
R8  12.5,27.5 270 top
R9  54,18.5 270 top
R10  56,18.5 270 top
R11  54.5,29.5 180 top
R12  73.5,35.5 270 top
R13  106.5,9 180 top
R14  106.5,7 180 top
R15  83,5 180 top
R16  141.5,25.5 90 top
R17  137.5,21.5 180 top
R18  121.5,36 0 top
R19  121.5,38 180 top
R20  118.25,6 270 top
R21  65.5,24 0 top
R22  120,6 270 top
R23  116.5,6 270 top
R24  11,7 180 top
R25  11,5 180 top
R26  121.5,30 0 top
R27  113.5,17 180 top
R28  113.5,15.5 180 top
R29  96,14 270 top
R30  100,14 270 top
R31  104,14 270 top
R32  98,14 90 top
R33  102,14 90 top
R37  121.5,32 0 top
R38  121.5,34 0 top
R39  121.5,28 0 top
R40  121.5,26 0 top
R41  121.5,24 0 top
RESET  138.5,0.5 0 top
RX  120,9 0 top
TP1  136.5,37 180 top
TP2  134,37 180 top
TP3  133.5,22 180 top
TP4  131,37.5 180 top
TP5  129,37.5 180 top
TP6  127,37.5 180 top
TP7  86.5,31.5 0 top
TP8  86.5,33.5 0 top
TP9  86.5,29.5 0 top
TX  118.25,9 0 top
U$1  [JANIS_10MM]  35,29 0 top
U$2  8,11.5 180 top
U$3  112,0 90 top
U$5  [GITHUB/JAN1S]  15,34 0 top
USER  116.5,9 0 top
Y1  89,27.5 90 top
Y2  58,29.5 0 top

### Tracks (layer width: path | path; a pad name or v marks a point on that pad's centre or on a via)
+5V  (via drill 0.4)  (2 unrouted)
  Top 0.254: JTAG.4 65.73,38.23 66.5,39 71,39 72,38 72,31.7 IC2.34 | 92.5,4.5 92.5,4.92 ISP1.2
  Top 0.406: 75.5,22.5 76,23 76,29.5 | 75.5,22.5 IC2.44 73.2,21.7 72.5,21 72.5,20 | IC1.8 58.1,21.9 59,21 60,21 | R6.2 60,20 | R5.2 60,21 | IC2.24 82.2,31.2 81.5,30.5 81.5,29.5 | 81.5,29.5 81.5,24.1 IC2.14 88.4,24.1 88.65,23.85 | 81.5,29.5 76,29.5 | C8.1 88.65,23.85 | 88.65,23.85 R1.2 | IC2.2 75.8,22.2 75.5,22.5 | 123.5,13 v124,12.5 | 72.5,20 72.5,18.5 76,15 79,15 79.5,14.5 79.5,14 | 72.5,20 70.5,20 | 70.5,20 68.5,20 | 68.5,20 62,20 | C19.1 68.5,20 | C20.1 70.5,20 | C6.1 62,20 | 62,20 60,20 | 60,20 60,21 | 76,29.5 75.5,29.5 74.5,30.5 IC2.34 | v94,6 92.5,6 92.5,4.5 | R23.2 R20.2 R22.2 116.65,5.15 116.5,5 111.5,5 v110,6.5 | 79.5,14 79.5,10.45 | 79.5,10.45 v79.5,9 | C11.1 79.5,14 | IC3.1 79.5,10.45
  Top 0.61: 52.5,5.5 53,6 v54,6 52.5,6 52.5,5.5 | JP1.6 52.54,5.46 52.5,5.5
  Top 0.813: 124.65,15.65 124.5,15.5 F1.P$2 | 41.88,7.38 42.5,7.5 | C17.1 135.15,13.2 IC4.3
  Top 1.016: v123,12.5 123.5,13
  Top 1.27: HV_MOD.4 41.88,7.38 | C3.1 42.5,7.5 v42.5,5.5 | v42.5,5.5 v42.5,4.5 v43.5,4.5 v43.5,5.5 v42.5,5.5 | 124.65,15.65 123.65,15.65 F1.P$2 123.5,13.5 | v132,13.5 132,13 | 132,13 v132,12.5 | v123,13.5 v123,12.5 v124,12.5 v124,13.5 | 132,13 135,13
  Bottom 0.406: v79.5,9 79.5,4.5 | v94,6 94,5 93.5,4.5
  Bottom 0.61: v54,6 54,4.5
  Bottom 1.27: v43.5,4.5 54,4.5 79.5,4.5 93.5,4.5 108,4.5 v110,6.5 113,9.5 119.5,9.5 123.5,13 | v43.5,4.5 v42.5,4.5 v42.5,5.5 v43.5,5.5 v43.5,4.5 | v124,12.5 v124,13.5 v123,13.5 | v123,13.5 v123,12.5 v124,12.5 | v123,13.5 123.5,13 | 123.5,13 v124,12.5 | v132,12.5 132,13 | v132,13.5 132,13 | 132,13 123.5,13
BOOTLED  (via drill 0.4)
  Top 0.254: IC2.32 75.8,33.3 79.5,37 92,37 97,32 97,31 v100.5,27.5 | USER.C 116.5,9.5 118,11 118,15 115,18 111,18 109,16 v107,16
  Bottom 0.254: v100.5,27.5 100.5,27 105.5,22 105.5,17.5 v107,16
D+
  Top 0.254: R3.2 127,12.5 127.5,13 127.5,16.5 123.5,20.5 95.5,20.5 93,18 77.5,18 77,18.5 77,19.5 77.4,19.9 IC2.4
D-
  Top 0.254: R4.2 126.5,16.5 123,20 96,20 93.5,17.5 77,17.5 76.5,18 76.5,19.75 76.6,19.85 IC2.3
DIS_EN  (via drill 0.4)
  Top 0.254: R29.1 v96,16 | IC2.27 79.8,34.3 81,35.5 90.5,35.5 95.5,30.5 95.5,28 v96,27.5
  Bottom 0.254: v96,27.5 v96,16
DIS_RCK  (via drill 0.4)  (1 unrouted)
  Top 0.254: v104,16 104,15 | IC2.29 78.2,34.7 80,36.5 91.5,36.5 96.5,31.5 96.5,30 v99,27.5
  Bottom 0.254: v104,16 104,21.5 99,26.5 v99,27.5
DIS_SCL  (via drill 0.4)
  Top 0.254: v97.5,16 98,15.5 R32.2 | IC2.28 79,34.5 80.5,36 91,36 96,31 96,29 v97.5,27.5
  Bottom 0.254: v97.5,27.5 v97.5,16
GND  (via drill 0.4)  (1 unrouted)
  Top 0.305: C4.2 78.65,18.85 78.2,19.3 IC2.5
  other vias: 142.75,31 142,31 141.25,31 140.5,31 126.5,32.5 137.5,32.5 137.5,31 134,32.5 134,31 130,32.5 130,31 137.5,28 137.5,26.5 134,26.5 134,28 130,26.5 130,28 126.5,26.5 126.5,28 126.5,31 136.5,34 135,34 136.5,29.5 135,29.5 136.5,25 135,25 131.5,25 131.5,34 129,25 127.5,25 127.5,34 129,34 133.5,34 133.5,25 133.5,29.5 131.5,29.5 129,29.5 127.5,29.5 128.25,10.5 77,26 80.5,26 83,25.5 75,26 77,22.5 81.5,23 75,23.5 77,28.5 80.5,28.5 82.5,29.5 75,28.5 73.5,32 135,18.5 137.5,20 139.5,16.5 136.5,16.5 135.5,16.5 134.5,16.5 140.5,16.5 141.5,16.5 141.5,15.5 141.5,14.5 141.5,13.5 141.5,12.5 133.5,16.5 133.5,15.5 133.5,14.5 135.5,11 139.5,11 139,10 139,9 136,10 136,9 141.5,11.5 140.5,11 134.5,11 133.5,11.5 140,9 140,10 140.5,8 140.5,7 140.5,6 135,9 135,10 134.5,8 134.5,7 134.5,6 134,10 134,9 141,9 141,10 129,10.25 129.75,10.25 120.5,12.5 124,17.5 122.5,19 106,14.5 105.5,16 108.5,14.5 110.5,4.5 112,6 130,15.5 132,18.5 128.25,18.5 118.5,18 134,2 120,16.5 142.75,1.5 67,21 67,22 66,22 66,21 65,21 65,22 64,21 64,27 61,30 57,31.5 59,31.5 120.25,21.75 121.25,21.75 122.25,21.75 84.25,32.25 88,33.5 118.5,32 80.5,16 119,35.25 110.25,34 102.25,29 99.25,34 104.25,34 94,15.5 80,2 78,2 86,2 84,2 73.75,19 81,7 82,2 52,2 68.75,12.75 52.75,15.25 52.75,12.75 68.75,15.25 62.25,15.25 62.25,12.75 56.75,24.75 52.25,27.25 85,14 143.5,31 145,29.5 144.25,29.25 145,26.5 144.25,25.5 144.25,24.75 144.25,30.75 144.75,30.25 144.25,28.5 144.25,27.75 145,27.5 144.25,26.25 144.25,27 140.5,34 141.25,34 142,34 142.75,34 143.5,34 144.25,34 145,34 146.25,33.25 146.75,32.75 147.25,32.25 147.75,31.75 148,31 145.75,33.75 148,30.25 148,29.5 148,28.75 148,28 148,27.25 148,26.5 148,25.75 148,25 143.5,24.75 143.5,24 143.5,23.25 143.5,22.5 143.5,21.75 143.5,21 143.5,20.25 143.5,19.5 143.5,18.75 143.5,18 143.5,17.25 143.5,16.5 143.5,15.75 143.5,15 143.5,14.25 143.5,13.5 143.5,12.75 143.5,12 143.5,10.75 143.5,9.5 143.5,8.25 143.5,7 143.5,5.75 143,4.5 143,3.25 143.5,2 126,40 100,40 102,40 104,40 106,40 108,40 110,40 112,40 114,40 116,40 118,40 120,40 122,40 124,40 128,40 130,40 132,40 134,40 136,40 138,40 140,40 142,40 148,34 98,40 96,40 94,40 92,40 90,40 88,40 86,40 84,40 82,40 80,40 78,40 76,40 74,40 72,40 66,40 64,40 62,40 60,40 58,40 56,40 54,40 52,40 50,40 48,40 46,40 44,40 42,40 40,40 38,40 36,40 34,40 32,40 30,40 28,40 26,40 24,40 22,40 20,40 18,40 16,40 14,40 12,40 10,40 8,40 2,34 2,32 2,30 2,28 2,26 2,24 2,22 2,20 2,18 2,16 2,14 2,12 2,10 2,8 8,2 10,2 12,2 14,2 16,2 18,2 20,2 22,2 24,2 26,2 28,2 30,2 32,2 34,2 36,2 38,2 40,2 42,2 44,2 50,2 54,2 56,2 58,2 60,2 62,2 64,2 66,2 96,2 98,2 100,2 102,2 104,2 106,2 118,2 120,2 130.5,10.25 129,9.5 129.75,9.5 130.5,9.5 131.25,9.5 68,40 70,40 94,2 92,2 90,2 88,2 68,2 70,2 72,2 74,2 76,2 81,12 80.5,9.5 83,9.5 85.5,7 95.5,6 95.5,9 104,9 71,30 76,35.5 46,2 48,2 36,5.5 36,4.5 38,3.5 39,3.5 40,3.5 14,11.5 15,11.5 16,11.5 18,10.5 18,9.5 21,14 13,30 21,22 13,14 9,18 50.5,32 37,25 9,22 33,22 9,26 29,22 9,30 17,30 25,22 21,30 33,14 25,30 37,14 29,30 41,14 33,30 29,14 37,30 25,14 41,30 17,14 25,20 37,20 42,14 43,14 44,14 25,10 29,10 33,10 37,10 21,10 41,20 41,25 49.5,20 62.25,6.75 68.75,6.75 95.25,37 70.75,18.25 58,19 90.75,25 91.25,22.5 91,29.5 71,34 124,2 126,2 128,2 106,13
  pour Top: 3,42 147,42 150,39 150,24.5 147.5,24.5 147.5,30 arc90 144,33.5 138.5,33.5 arc90 138,33 138,32 arc90 138.5,31.5 144,31.5 arc-90 145.5,30 145.5,24.5 144,24.5 144,2 142,0 49.5,0 49.5,15.5 46,19 22.5,19 17,24.5 13.5,24.5 13.5,25.5 11.5,25.5 11.5,24.5 10.5,24.5 10,24 10,18.5 11.5,17 17,17 19,15 44,15 45.5,13.5 45.5,0 3,0 0,3 0,39
  pour Bottom: 3,42 147,42 150,39 150,24.5 144,24.5 144,2 142,0 3,0 0,3 0,39
  pour Top: 45.5,0 49.5,0 49.5,6.5 45.5,6.5
HV_ADC  (1 unrouted)
  Top 0.254: IC2.40 67.8,25.7 63,30.5 63,32.5 62,33.5 | R8.2 12.5,26.5 | 12.5,26.5 R2.1 | 62,33.5 49.5,33.5 42.5,26.5 12.5,26.5 | 62,33.5 62,35
HV_EN  (via drill 0.4)
  Top 0.254: v61.5,32.5 61,32.5 60.5,33 50,33 47.5,30.5 47.5,25.5 44.65,22.65 R7.2 42.47,22.62 HV_MOD.7 | IC2.31 76.6,31.1 v76,30.5
  Bottom 0.254: v61.5,32.5 71,32.5 73,30.5 v76,30.5
I2C_SCL  (via drill 0.4)
  Top 0.254: IC2.18 83.3,27.3 v83,27 | R6.1 60.65,17.65 61.5,18.5 v61.5,19
  Top 0.305: R10.2 R6.1
  Bottom 0.254: v83,27 68.5,27 61.5,20 v61.5,19
I2C_SDA  (via drill 0.4)
  Top 0.254: IC2.19 83.4,28.1 v83,28.5 | 60.15,22.85 R5.1 60,23.5 | v60,24 60,23.5 | 60,23.5 59.5,23.5 59.35,23.5 53.5,23.5 53,23 53,18 53.35,17.65 R9.2
  Bottom 0.254: v83,28.5 82,27.5 68,27.5 64.5,24 v60,24
JTAG_TCK
  Top 0.254: IC2.39 68,26.5 64.46,30.04 JTAG.1
JTAG_TDI
  Top 0.254: IC2.36 70.6,28.9 69.54,29.96 JTAG.9
JTAG_TDO
  Top 0.254: IC2.37 69.4,28.1 67.5,30 66.5,30 65.73,30.77 JTAG.3
JTAG_TMS  (via drill 0.4)
  Top 0.254: IC2.38 68.2,27.3 67,28.5 v67,29 | JTAG.5 v67,31
  Bottom 0.254: v67,31 v67,29
N$1
  Top 0.254: CN1.D- 125.7,13.2 126.5,14 R4.1
N$2
  Top 0.254: CN1.D+ 126.5,10.15 R3.1
N$3
  Top 0.254: TX.A R20.1
N$4
  Top 0.254: IC1.1 57.91,28.91 58.5,29.5 Y2.P$2
N$5
  Top 0.254: IC1.3 55.37,28.98 R11.1
  Top 0.305: IC1.3 55.37,25.36 55,25 52,25 51.5,24.5 51.5,14.5 52,14 70.08,14 BAT1.POS
N$6
  Top 0.305: R12.2 73.5,33.5 74.5,32.5 75,32.5 IC2.33
N$7
  Top 0.254: IC1.2 56.63,29.39 Y2.P$1
N$8
  Top 0.406: C5.2 R21.2
N$9
  Top 0.254: IC2.42 70.45,24.1 C5.1
N$10
  Top 0.254: RX.A R22.1
N$11
  Top 0.254: USER.A R23.1
N$12
  Top 0.406: CN1.VBUS 124.9,10.1 124.5,10.5 F1.P$1
N$13
  Top 0.254: R24.1 14.55,7 HV_MOD.2
N$14
  Top 0.254: U$2.B 8.45,7 R24.2 R25.2
N$15  (via drill 0.4)
  Top 0.254: R27.2 v111.5,17 | v112.5,26.5 112.5,28.5 111.59,29.41 IC5.11
  Bottom 0.254: v111.5,17 113.5,19 113.5,25.5 v112.5,26.5
N$16
  Top 0.406: IC3.4 84.3,7.45 C9.1
N$17
  Top 0.5: MOD1.35 C13.1
N$18
  Top 0.5: C13.2 144,32.5 arc-90 146.5,30 146.5,28.5 L2.2 arc-90 146.5,28.4 C12.1
N$19
  Top 0.5: C12.2 146.5,25.5 | 146.5,25.5 ANT1.ANT | L1.2 146.5,25.5
N$20
  Top 0.254: R16.1 140.85,24.65 140.2,25.3 MOD1.29
N$21
  Top 0.254: R16.2 140.65,26.35 140.5,26.5 MOD1.30
N$22
  Top 0.254: MOD1.27 136.2,22.8 136.65,22.35 R17.2
N$23
  Top 0.254: MOD1.28 137.4,23.1 138.35,22.15 R17.1
N$24
  Top 0.254: MOD1.5 132.6,37.4 131,39 121.5,39 120.65,38.15 R19.2
N$25
  Top 0.254: MOD1.7 130.2,36.3 130,36.5 130,38 129.5,38.5 122.85,38.5 R19.1 R18.2
N$26
  Top 0.254: MOD1.2 136.2,36.7 TP1.TP
N$27
  Top 0.254: MOD1.4 133.8,36.8 TP2.TP
N$28
  Top 0.254: MOD1.24 132.6,22.9 TP3.TP
N$29
  Top 0.254: R38.1 113,34 112.5,33.5 112.5,31.5 111.67,30.68 IC5.10
N$30  (via drill 0.4)
  Top 0.254: R28.2 v111,15.5 | v112.5,25 111.91,25.59 IC5.14
  Bottom 0.254: v111,15.5 110.5,16 110.5,17 113,19.5 113,24.5 v112.5,25
N$31
  Top 0.254: R39.1 119.5,28 118.09,29.41 IC5.6
N$37
  Top 0.254: R40.1 119.5,26 118.64,26.86 IC5.4
N$38
  Top 0.254: R41.1 119.5,24 119.17,24.32 IC5.2
RESET  (via drill 0.4)  (1 unrouted)
  Top 0.254: 87.46,10.96 87.5,11 87.5,15.5 v87,16 | JTAG.6 67,38 67.5,38.5 70.5,38.5 71,38 v71,37.5 | RESET.B 140.65,3.15 140,2.5 137,2.5 136.5,3 135.55,3 | 135.55,3 RESET.A | v83,23 83.3,23.3 IC2.13 85.7,23.3 v87,22 87.5,21.5 88,21.5 | 135.55,3 134.5,3 133,4.5 133,9 131,11 129,11 128,12 128,17 124,21 116,21 v115.5,21.5 | 90,21.5 91.5,21.5 94,24 107,24 v107.5,23.5 | 90,21.5 88,21.5 | C8.2 88,21.5 | R1.1 90,21.5
  Bottom 0.254: v83,23 84.5,24.5 84.5,30.5 77.5,37.5 v71,37.5 | v87,22 v87,16 | v115.5,21.5 115,22 115,26.5 113.5,28 111.5,28 109.5,26 109.5,25 108,23.5 v107.5,23.5
RTC_ADC
  Top 0.254: R11.2 C7.1 53.65,31.65 54.5,32.5 60,32.5 67.6,24.9 IC2.41
RTC_SCL
  Top 0.305: IC1.6 55.37,19.98 R10.1
RTC_SDA
  Top 0.305: IC1.5 54.09,19.45 R9.1
RXLED  (via drill 0.4)
  Top 0.254: IC2.8 80.6,21.9 v80,22.5 | v92.5,24.5 107,24.5 v107.5,25 | RX.C 120,10 119,11 119,16 116,19 109.5,19 v108.5,18
  Bottom 0.254: v80,22.5 81,21.5 84.5,21.5 86.5,23.5 91.5,23.5 v92.5,24.5 | v107.5,25 106.5,24 106.5,18.5 107,18 v108.5,18
SPI_MISO  (via drill 0.4)
  Top 0.254: R37.1 120,32 118.5,33.5 115,33.5 114.5,33 114.5,31 114,30.5 114,29 113.5,28.5 113.5,22.5 113,22 106,22 105,23 95,23 92.5,20.5 90.5,20.5 | IC2.11 83,20.5 90.5,20.5 | v90.5,20 90.5,20.5 | v92,15.5 92.54,14.96 ISP1.1
  Bottom 0.254: v90.5,20 92,18.5 v92,15.5
SPI_MOSI  (via drill 0.4)
  Top 0.254: v91,15 91,5.96 ISP1.4 | R33.2 v102,16 | IC2.10 82.2,19.8 82.5,19.5 83.5,19.5 84,20 89,20 v89.5,19.5 90,19 92,19 95.5,22.5 101,22.5 | 101,22.5 v101,22 | IC5.7 115.17,30.68 114.5,30 114.5,28.5 114,28 114,22 113.5,21.5 105.5,21.5 104.5,22.5 101,22.5
  Bottom 0.254: v101,22 102,21 v102,16 | v91,15 91,18 v89.5,19.5
SPI_SCLK  (via drill 0.4)
  Top 0.254: IC2.9 81.4,19.6 82.5,18.5 88.5,18.5 | 100,21 95,21 92.5,18.5 88.5,18.5 | 100,21 114,21 114.5,21.5 114.5,27.5 115.14,28.14 IC5.5 | 100,21 v100,21.5 | R30.1 v100,16 | 88.5,18.5 v88.5,19 | v90,14.5 ISP1.3
  Bottom 0.254: v100,21.5 v100,16 | v90,14.5 90,17.5 v88.5,19
SR_EN
  Top 0.254: JP2.1 97.46,11.04 96,12.5 R29.2
SR_MOSI
  Top 0.254: JP2.4 100,6 101.5,7.5 101.5,12.65 R33.1
SR_RCK
  Top 0.254: JP2.5 102.54,11.04 104,12.5 R31.2
SR_SCK
  Top 0.254: JP2.3 R30.2
SR_SCL
  Top 0.254: JP2.2 97.46,5.96 98.5,7 98.5,12.65 R32.1
TRS_3V3  (via drill 0.4)
  Top 0.406: U$3.1 112,11 111.5,10.5 106.5,10.5 105.65,9.65 R13.2 R14.2 105.65,7.35 105.5,7 v104,7 | C10.1 84.3,11.55 IC3.5 85.05,10.45 v85.5,10
  Bottom 0.406: v85.5,10 88,7.5 103.5,7.5 v104,7
TRS_3V3_EN  (via drill 0.4)
  Top 0.254: IC2.30 77.4,30.6 v77.5,30.5 | IC3.3 80.55,8.55 80,8 | R15.2 80.5,5 80,5.5 80,8 | v78.5,28.5 v78.5,25 | 80,8 79,8 78.5,8.5 v78.5,14
  Bottom 0.254: v77.5,30.5 78,30 78,29 v78.5,28.5 | v78.5,25 v78.5,14
TRS_DCF77
  Top 0.254: R13.1 112.5,9 115.5,12 U$3.3 115.5,14.5 114.5,15.5 R28.1
TRS_GPS
  Top 0.254: R14.1 108,7 | 108,7 108.5,6.5 108.5,3.5 | U$3.4 108.2,3.2 108.5,3.5 | 108.5,3.5 115.25,3.5 U$3.4-2 116,3.25 | 108,7 109.5,8.5 113,8.5 115.5,11 117,11 117.5,11.5 117.5,14 114.5,17 R27.1
TXLED  (via drill 0.4)
  Top 0.254: IC2.22 84.8,31.3 86,32.5 90.5,32.5 94,29 94,26 94.5,25.5 105,25.5 v106.5,27 | TX.C 118.5,10 118.5,15.5 115.5,18.5 110.5,18.5 109,17 v108,17
  Bottom 0.254: v106.5,27 106.5,25.5 106,25 106,18 107,17 v108,17
UART_RX
  Top 0.254: IC2.20 86.4,28.9 87,29.5 | 87,29.5 87,30.5 87.5,31 91,31 93.5,28.5 93.5,25.5 94,25 106,25 109.14,28.14 IC5.12 | TP9.TP 87,29.5
UART_TX
  Top 0.254: IC2.21 85.45,29.7 86.5,30.75 TP7.TP
UC_DCF77
  Top 0.254: IC5.15 108.83,24.32 108.5,24 108.5,23 108,22.5 106.5,22.5 105.5,23.5 94.5,23.5 92,21 85.5,21 84.8,21.7 IC2.12
UCAP
  Top 0.305: C4.1 80.35,18.65 79,20 IC2.6
VDD
  Top 0.254: HV_MOD.1 12.92,20.08 12.5,20.5 R2.2
  Top 0.61: HV_MOD.1 17.42,20.08 20.5,17 45,17 47.46,14.54 JP1.1
WIFI_CS
  Top 0.254: IC5.9 108.44,31.95 103,26.5 95.5,26.5 95,27 95,30 90,35 81.5,35 80.6,34.1 IC2.26
WIFI_EN  (via drill 0.4)
  Top 0.254: IC5.3 118.41,25.59 v118.5,25.5 | IC2.25 81.4,33.9 82,34.5 89.5,34.5 94.5,29.5 94.5,26.5 95,26 104,26 v106.5,28.5
  Bottom 0.254: v106.5,28.5 114,28.5 117,25.5 v118.5,25.5
WIFI_IRQ  (via drill 0.4)
  Top 0.254: R26.1 v119.5,30 | v121,19 120.5,19.5 96.5,19.5 94,17 76.5,17 75,18.5 IC2.1
  Bottom 0.254: v119.5,30 119.5,20.5 v121,19
WL_3V3
  Top 0.406: MOD1.23 131.4,21.55 C14.1 | MOD1.19 126.6,21.55 C15.1 125.5,21.5 124.5,22.5 120,22.5 119.44,23.05 IC5.1 116.9,22.73 C18.1
  Top 0.813: 131.5,20 135.5,20 138.15,17.35 C16.1 138.15,13.8 IC4.2 IC4.4 | C14.1 131.35,20.65 131.5,20 | 131.5,20 127.5,20 126.65,20.85 C15.1
WL_EN  (via drill 0.4)
  Top 0.254: R41.2 v123,24 | v135,22 MOD1.26
  Bottom 0.254: v123,24 123,22 123.5,21.5 134.5,21.5 v135,22
WL_SPI_CLK
  Top 0.254: MOD1.17 123.5,26.5 123,26 R40.2
WL_SPI_CS
  Top 0.254: MOD1.12 124,32.5 122.5,34 R38.2
WL_SPI_DIN
  Top 0.254: MOD1.15 123.9,28.9 123,28 R39.2
WL_SPI_DOUT
  Top 0.254: MOD1.13 123.7,31.3 123,32 R37.2
WL_SPI_IRQ
  Top 0.254: MOD1.14 123.6,30.1 123.5,30 R26.2
WL_UART_RX
  Top 0.254: TP5.TP MOD1.8
WL_UART_TX
  Top 0.254: TP4.TP 131,36.5 131.4,36.1 MOD1.6
XTAL1
  Top 0.254: IC2.17 87,26.5 87.5,27 87.5,28.5 | C2.2 88,30 87.5,29.5 87.5,28.5 | Y1.CRYSTAL2 87.7,28.3 87.5,28.5
XTAL2
  Top 0.254: IC2.16 89.5,25.7 | 89.5,25.7 90.2,25.7 91,26.5 C1.2 | Y1.CRYSTAL1 89.6,25.8 89.5,25.7

### Text on the board
tPlace: High | Voltage
tDocu: Nixie Socket Area